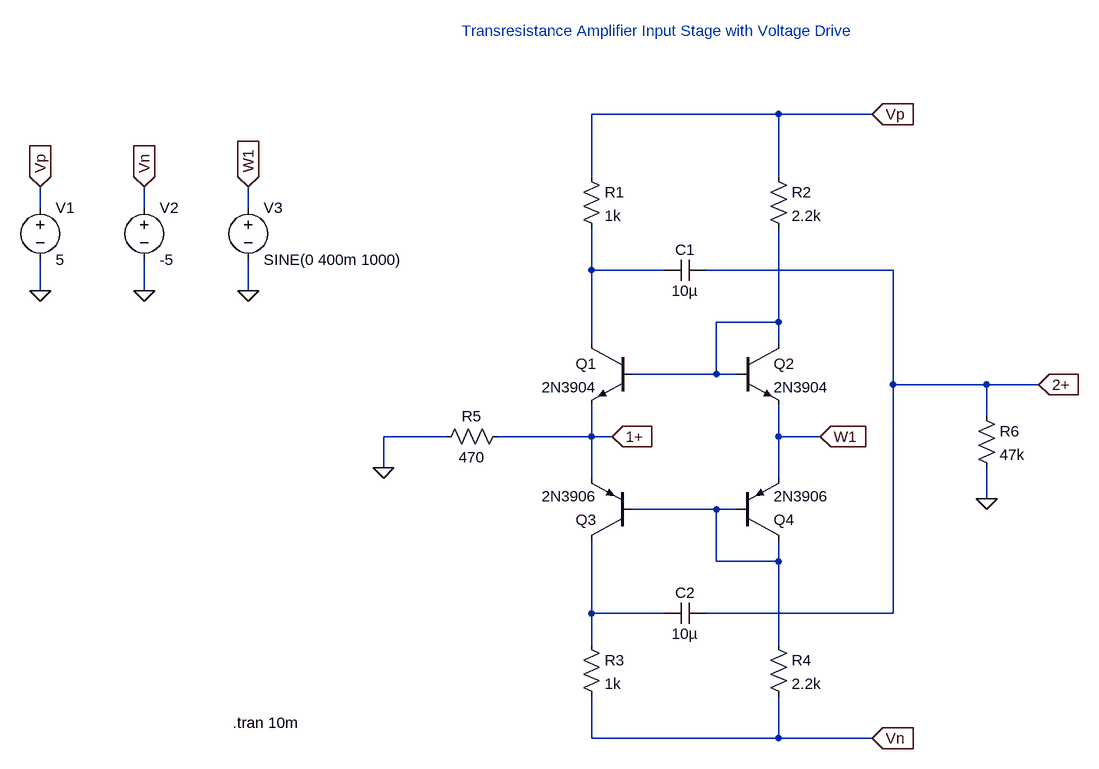
[diagram p0: schematic tr_amp_in_vdrv_ltspice.asc]
tr_amp_in_vdrv_ltspice.asc, the LTspice schematic file:
Version 4
SHEET 1 952 844
WIRE 416 -208 128 -208
WIRE 560 -208 416 -208
WIRE 128 -112 128 -208
WIRE 416 -112 416 -208
WIRE -720 -64 -720 -96
WIRE -560 -64 -560 -96
WIRE -400 -64 -400 -96
WIRE 128 32 128 -32
WIRE 240 32 128 32
WIRE 592 32 304 32
WIRE -720 64 -720 16
WIRE -560 64 -560 16
WIRE -400 64 -400 16
WIRE 416 112 416 -32
WIRE 416 112 320 112
WIRE 128 144 128 32
WIRE 416 144 416 112
WIRE 320 192 320 112
WIRE 320 192 192 192
WIRE 352 192 320 192
WIRE 592 208 592 32
WIRE 736 208 592 208
WIRE 816 208 736 208
WIRE 736 256 736 208
WIRE -96 288 -192 288
WIRE 128 288 128 240
WIRE 128 288 -16 288
WIRE 160 288 128 288
WIRE 416 288 416 240
WIRE 480 288 416 288
WIRE -192 336 -192 288
WIRE 128 352 128 288
WIRE 416 352 416 288
WIRE 736 384 736 336
WIRE 320 400 192 400
WIRE 352 400 320 400
WIRE 320 480 320 400
WIRE 416 480 416 448
WIRE 416 480 320 480
WIRE 128 560 128 448
WIRE 240 560 128 560
WIRE 592 560 592 208
WIRE 592 560 304 560
WIRE 128 608 128 560
WIRE 416 608 416 480
WIRE 128 752 128 688
WIRE 416 752 416 688
WIRE 416 752 128 752
WIRE 560 752 416 752
FLAG 736 384 0
FLAG 560 -208 Vp
IOPIN 560 -208 In
FLAG 560 752 Vn
IOPIN 560 752 In
FLAG -720 64 0
FLAG -560 64 0
FLAG -400 64 0
FLAG -720 -96 Vp
IOPIN -720 -96 In
FLAG -560 -96 Vn
IOPIN -560 -96 In
FLAG -400 -96 W1
IOPIN -400 -96 In
FLAG -192 336 0
FLAG 480 288 W1
IOPIN 480 288 In
FLAG 160 288 1+
IOPIN 160 288 In
FLAG 816 208 2+
IOPIN 816 208 In
SYMBOL res 112 -128 R0
SYMATTR InstName R1
SYMATTR Value 1k
SYMBOL res 400 -128 R0
SYMATTR InstName R2
SYMATTR Value 2.2k
SYMBOL res 112 592 R0
SYMATTR InstName R3
SYMATTR Value 1k
SYMBOL res 400 592 R0
SYMATTR InstName R4
SYMATTR Value 2.2k
SYMBOL res 0 272 R90
WINDOW 0 0 56 VBottom 2
WINDOW 3 32 56 VTop 2
SYMATTR InstName R5
SYMATTR Value 470
SYMBOL res 720 240 R0
SYMATTR InstName R6
SYMATTR Value 47k
SYMBOL npn 192 144 M0
SYMATTR InstName Q1
SYMATTR Value 2N3904
SYMBOL npn 352 144 R0
SYMATTR InstName Q2
SYMATTR Value 2N3904
SYMBOL pnp 192 448 R180
SYMATTR InstName Q3
SYMATTR Value 2N3906
SYMBOL pnp 352 448 M180
SYMATTR InstName Q4
SYMATTR Value 2N3906
SYMBOL cap 304 16 R90
WINDOW 0 0 32 VBottom 2
WINDOW 3 32 32 VTop 2
SYMATTR InstName C1
SYMATTR Value 10µ
SYMBOL cap 304 544 R90
WINDOW 0 0 32 VBottom 2
WINDOW 3 32 32 VTop 2
SYMATTR InstName C2
SYMATTR Value 10µ
SYMBOL voltage -720 -80 R0
WINDOW 123 0 0 Left 0
WINDOW 39 0 0 Left 0
SYMATTR InstName V1
SYMATTR Value 5
SYMBOL voltage -560 -80 R0
WINDOW 123 0 0 Left 0
WINDOW 39 0 0 Left 0
SYMATTR InstName V2
SYMATTR Value -5
SYMBOL voltage -400 -80 R0
WINDOW 123 0 0 Left 0
WINDOW 39 0 0 Left 0
SYMATTR InstName V3
SYMATTR Value SINE(0 400m 1000)
TEXT -424 728 Left 2 !.tran 10m
TEXT -72 -336 Left 2 ;Transresistance Amplifier Input Stage with Voltage Drive

The netlist it stands for:
* tr_amp_in_vdrv_ltspice.asc
R1 Vp N001 1k
R2 Vp N002 2.2k
R3 N004 Vn 1k
R4 N003 Vn 2.2k
R5 1+ 0 470
R6 2+ 0 47k
Q1 N001 N002 1+ 0 2N3904
Q2 N002 N002 W1 0 2N3904
Q3 N004 N003 1+ 0 2N3906
Q4 N003 N003 W1 0 2N3906
C1 2+ N001 10µ
C2 2+ N004 10µ
V1 Vp 0 5
V2 Vn 0 -5
V3 W1 0 SINE(0 400m 1000)
.model NPN NPN
.model PNP PNP
.lib standard.bjt
.tran 10m
* Transresistance Amplifier Input Stage with Voltage Drive
.backanno
.end